# EAGLE design Power_Amp (EAGLE 9.6.2)
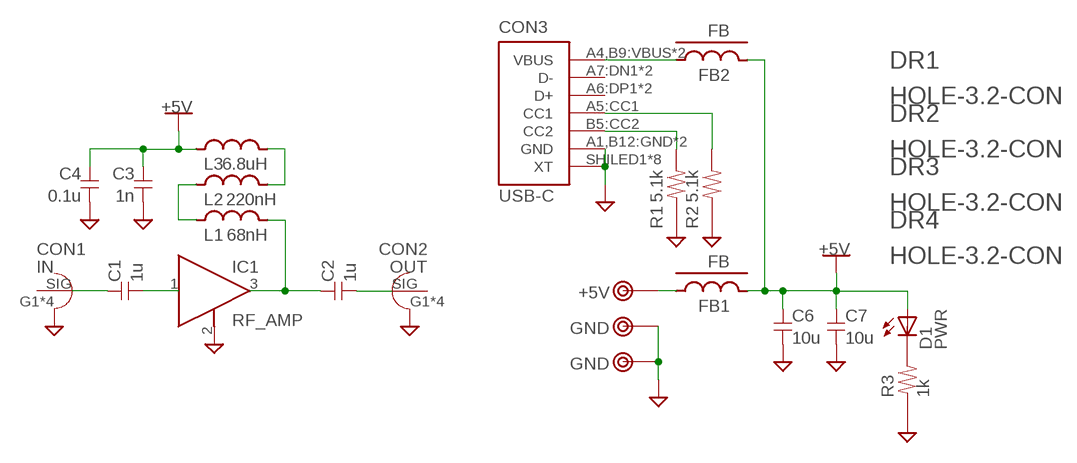
[diagram p0: schematic, sheet 1]

## Parts
C1  1u  C-1608-3  [1608-3]
C2  1u  C-1608-3  [1608-3]
C3  1n  C-1005  [1005]
C4  0.1u  C-1608  [1608C]
C6  10u  C-2012  [2012]
C7  10u  C-2012  [2012]
CON1  IN  SMA-EDGE3  [SMA-EDGE3]
CON2  OUT  SMA-EDGE3  [SMA-EDGE3]
CON3  USB-C  [5077CR-16-SMC2-BK-TR]
D1  PWR  LED-SMD1608  [D1608]
DR1  HOLE-3.2-CON  [HOLE_3.2_CON]
DR2  HOLE-3.2-CON  [HOLE_3.2_CON]
DR3  HOLE-3.2-CON  [HOLE_3.2_CON]
DR4  HOLE-3.2-CON  [HOLE_3.2_CON]
FB1  FB  FB-1608FB  [1608-FB]
FB2  FB  FB-1608FB  [1608-FB]
IC1  RF_AMP  [SOT89]
L1  68nH  L-1005  [1005]
L2  220nH  L-1608  [1608]
L3  6.8uH  L-1608  [1608]
R1  5.1k  R-1608  [1608]
R2  5.1k  R-1608  [1608]
R3  1k  R-1608  [1608]
TP1  +5V  TESTPIN  [TESTPIN]
TP2  GND  TESTPIN  [TESTPIN]
TP3  GND  TESTPIN  [TESTPIN]

## Nets
+5V: C3.1 C4.1 C6.1 C7.1 D1.A FB1.2 FB2.2 L3.1
GND: C3.2 C4.2 C6.2 C7.2 CON1.G1(GND) CON1.G2(GND) CON1.G3(GND) CON1.G4(GND) CON2.G1(GND) CON2.G2(GND) CON2.G3(GND) CON2.G4(GND) CON3.A1,B12:GND(GND) CON3.B1,A12:GND(GND) CON3.SHILED1(XT) CON3.SHILED2(XT) CON3.SHILED3(XT) CON3.SHILED4(XT) CON3.SHILED5(XT) CON3.SHILED6(XT) CON3.SHILED7(XT) CON3.SHILED8(XT) IC1.2(GND) R1.1 R2.1 R3.1 TP2.1 TP3.1
N$1: C1.2 IC1.1(IN)
N$2: C1.1 CON1.SIG
N$3: C2.1 IC1.3(OUT) L1.2
N$4: L1.1 L2.1
N$5: L2.2 L3.2
N$6: C2.2 CON2.SIG
N$7: FB1.1 TP1.1
N$8: D1.K R3.2
N$9: CON3.B5:CC2(CC2) R1.2
N$10: CON3.A5:CC1(CC1) R2.2
N$11: CON3.A4,B9:VBUS(VBUS) CON3.B4,A9:VBUS(VBUS) FB2.1
Unconnected: CON3.A6:DP1(D+) CON3.A7:DN1(D-) CON3.B6:DP2(D+) CON3.B7:DN2(D-)

## Library data of the parts
C1-C4 C6 C7 = my_rcl:C
CON1 CON2 = my_connector:SMA
CON3 = my_connector:USB-C
D1 = my_rcl:LED
DR1-DR4 = my_connector:HOLE-3.2
FB1 FB2 = my_rcl:FB
IC1 = my_ic:RF_AMP
L1-L3 = my_rcl:L
R1-R3 = my_rcl:R
TP1-TP3 = my_connector:TESTPIN

## Board
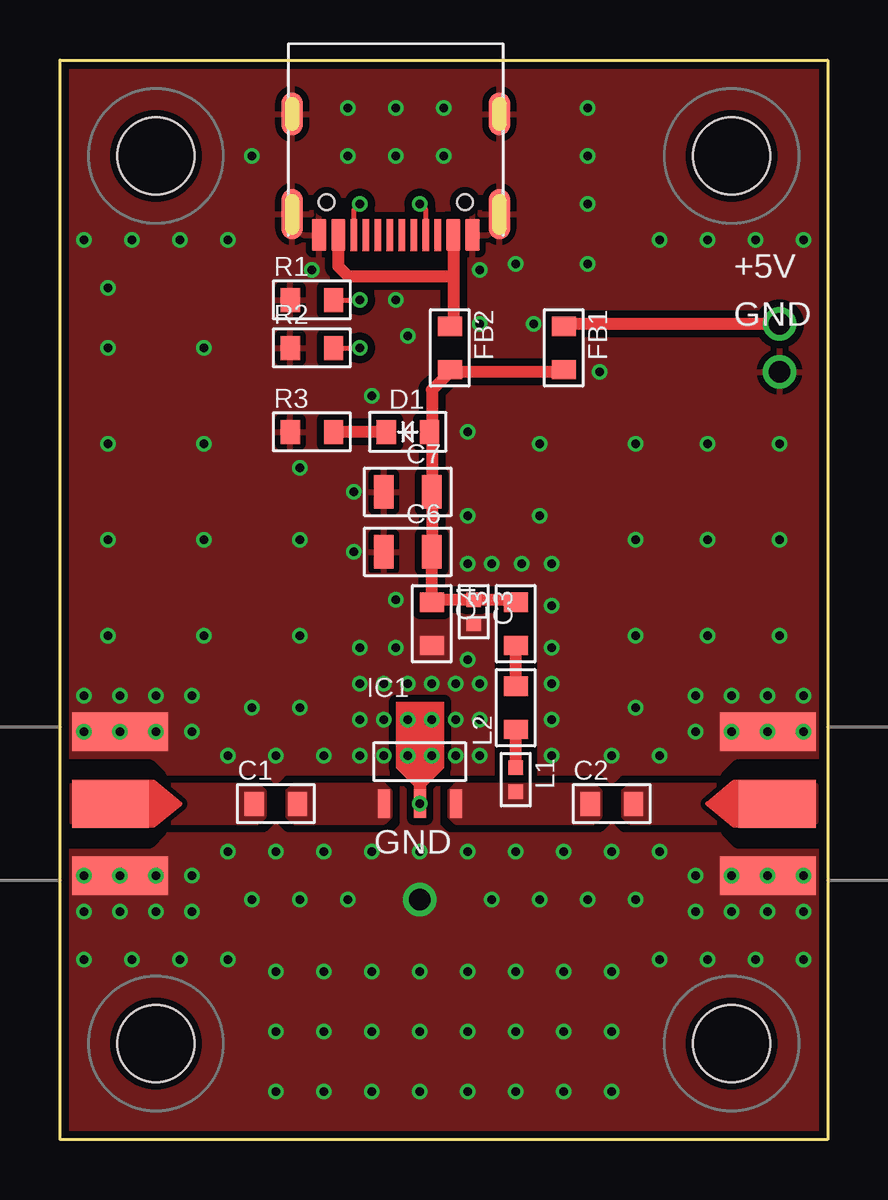
[diagram p1: board, top side]
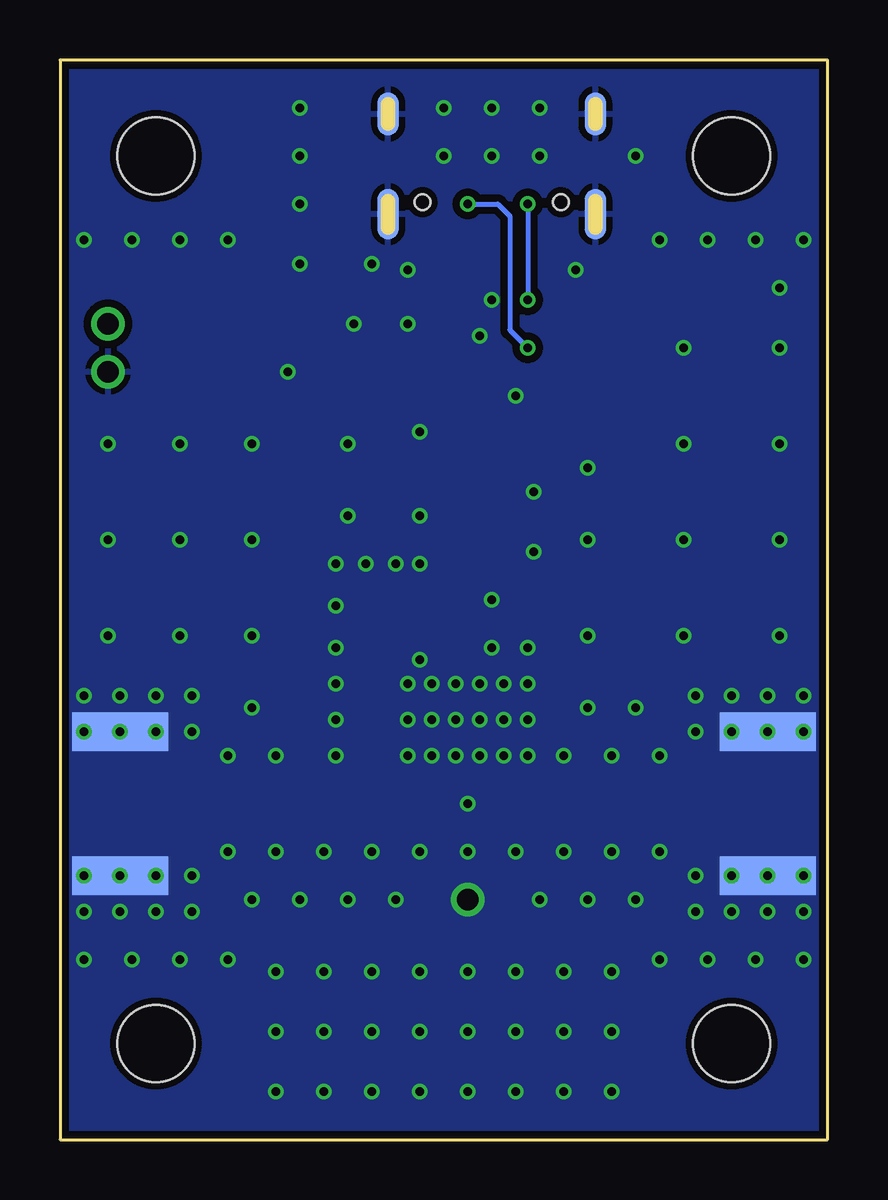
[diagram p2: board, bottom side, seen from below]

Size 32 x 45 mm. Coordinates in mm from the lower left corner, seen from the top.
Outline: 0,0 0,45 32,45 32,0 0,0
Copper layers (1*16): Top 0.035mm / dielectric 1.5mm / Bottom 0.035mm
Design rules "SeeedStudio_2layer_DRU_20140221 *": minimum track width 6mil, minimum drill 0.3mm, track to track 8mil, track to pad 8mil, pad to pad 7mil, via to via 12mil, smd to smd 0mil, copper to edge 0.3mm, drill to drill 10mil, minimum pad ring 0.15mm, minimum via ring 6mil, stop-mask expansion 2mil, vias tented up to drill 1mm, thermal gap 10mil

### Footprints (pad centres in the part's own frame; a part is rotated, then mirrored left to right if it is on the bottom)
1608-3 = smd 0.8 x 1: 1 -0.9,0; 2 0.9,0
1005 = smd 0.6 x 0.6: 1 -0.5,0; 2 0.5,0
1608C = smd 0.8 x 1: 1 -0.9,0; 2 0.9,0
2012 = smd 0.8 x 1.4: 1 -1,0; 2 1,0
SMA-EDGE3 = smd 1.6 x 4: G1 -3,0; G2 3,0 | smd 1.6 x 4 bottom: G3 -3,0; G4 3,0 | smd 2 x 3.2: SIG 0,0.4
5077CR-16-SMC2-BK-TR = smd 0.6 x 1.34: A1,B12:GND -3.2,0.3; A4,B9:VBUS -2.4,0.3; B1,A12:GND 3.2,0.3; B4,A9:VBUS 2.4,0.3 | smd 0.3 x 1.34: A5:CC1 -1.25,0.3; A6:DP1 -0.25,0.3; A7:DN1 0.25,0.3; A8:SBU1 1.25,0.3; B5:CC2 1.75,0.3; B6:DP2 0.75,0.3; B7:DN2 -0.75,0.3; B8:SBU2 -1.75,0.3 | smd 0.9 x 2.1: SHILED1 -4.32,-0.57; SHILED2 4.32,-0.57 | smd 0.9 x 1.8: SHILED3 -4.32,-4.75; SHILED4 4.32,-4.75 | smd 0.9 x 2.1 bottom: SHILED5 -4.32,-0.57; SHILED7 4.32,-0.57 | smd 0.9 x 1.8 bottom: SHILED6 -4.32,-4.75; SHILED8 4.32,-4.75 | hole 0.65: -2.89,-1.07; 2.89,-1.07
D1608 = smd 0.8 x 1: A 0.9,0; K -0.9,0
HOLE_3.2_CON = hole 3.2: 0,0
1608-FB = smd 0.8 x 1: 1 -0.9,0; 2 0.9,0
SOT89 = smd 0.5 x 1.2: 1 -1.5,-1.75; 2 0,-1.75; 3 1.5,-1.75
1608 = smd 0.8 x 1: 1 -0.9,0; 2 0.9,0
TESTPIN = drill 0.9 pad 1.4: 1 0,0

### Placement (x,y rotation side)
C1  9,14 0 top
C2  23,14 0 top
C3  17.25,22 270 top
C4  15.5,21.5 270 top
C6  14.5,24.5 180 top
C7  14.5,27 180 top
CON1  2.5,14 90 top
CON2  29.5,14 270 top
CON3  14,38 180 top
D1  14.5,29.5 0 top
DR1  4,4 0 top
DR2  28,4 0 top
DR3  28,41 0 top
DR4  4,41 0 top
FB1  21,33 270 top
FB2  16.25,33 270 top
IC1  15,15.75 0 top
L1  19,15 270 top
L2  19,18 90 top
L3  19,21.5 270 top
R1  10.5,35 0 top
R2  10.5,33 0 top
R3  10.5,29.5 0 top
TP1  30,34 0 top
TP2  30,32 0 top
TP3  15,10 0 top

### Tracks (layer width: path | path; a pad name or v marks a point on that pad's centre or on a via)
+5V
  Top 0.508: L3.1 18.9,22.5 C3.1 15.6,22.5 C4.1 C6.1 C7.1 15.5,29.5 | 15.5,29.5 15.5,31.25 16.25,32 FB2.2 16.35,32 20.9,32 FB1.2 | D1.A 15.5,29.5
GND  (via drill 0.35)
  other vias: 1,17 2.5,17 4,17 4,18.5 2.5,18.5 1,18.5 5.5,18.5 5.5,17 1,11 2.5,11 4,11 5.5,11 5.5,9.5 4,9.5 2.5,9.5 1,9.5 31,17 29.5,17 28,17 26.5,17 26.5,18.5 28,18.5 29.5,18.5 31,18.5 31,11 29.5,11 28,11 26.5,11 26.5,9.5 28,9.5 29.5,9.5 31,9.5 14.5,17.5 15.5,17.5 15.5,16 14.5,16 16.5,17.5 16.5,16 17.5,16 17.5,17.5 17.5,19 16.5,19 15.5,19 14.5,19 13.5,19 13.5,17.5 13.5,16 12.5,16 12.5,17.5 12.5,19 7,16 7,12 9,12 9,16 11,16 11,12 13,12 15,12 17,12 19,12 23,16 23,12 25,12 25,16 21,12 20.5,16 12,10 10,10 18,10 20,10 22,10 12.25,27 12.25,24.5 17,20 14,20.5 12.5,20.5 20.5,17.5 20.5,19 20.5,20.5 20.5,22.25 20.5,24 19.25,24 18,24 17,24 14,22.5 8,18 10,18 24,18 17,26 17,29.5 22,36.5 19,36.5 19.75,34 22.5,32 14,35 14.5,33.5 12,43 14,43 16,43 16,41 14,41 12,41 2,33 17.5,34 2,35.5 2,21 2,25 2,29 30,21 30,25 30,29 27,29 22,39 15,14 8,10 24,10 15,2 13,2 11,2 9,2 17,2 19,2 21,2 23,2 15,7 13,7 11,7 9,7 17,7 19,7 21,7 23,7 15,4.5 13,4.5 11,4.5 9,4.5 17,4.5 19,4.5 21,4.5 23,4.5 1,7.5 3,7.5 5,7.5 7,7.5 31,7.5 29,7.5 27,7.5 25,7.5 31,37.5 29,37.5 27,37.5 25,37.5 1,37.5 3,37.5 5,37.5 7,37.5 22,41 22,43 8,41 6,29 10,28 10,25 6,25 6,21 10,21 24,29 24,25 27,25 27,21 24,21 20,29 20,26 10.5,36.25 17.5,36.25 6,33 13,31
  pour Top (isolate 0.305, rank 4): 0,45 0,0 32,0 32,45
  pour Bottom (isolate 0.305, rank 4): 0,45 0,0 32,0 32,45
  cutout Top (no thermals): 18.25,23 19.75,23 19.75,15.25 18.25,15.25
  pour Bottom (isolate 0.305, rank 4, no thermals): 0,23.5 0,8 32,8 32,23.5
  pour Top (isolate 0.305, rank 4, no thermals): 0,23.5 0,8 32,8 32,23.5
N$1
  pour Top (no thermals): 9.5,14.5 9.5,13.5 9.75,13.25 13.5,13.25 13.75,13.5 13.75,14.5 13.5,14.75 9.75,14.75
N$2
  pour Top (no thermals): 0.5,14.75 0.5,13.25 8.25,13.25 8.5,13.5 8.5,14.5 8.25,14.75
N$3
  pour Top (no thermals): 16.5,14.75 16.25,14.5 16.25,13.5 16.5,13.25 22.25,13.25 22.5,13.5 22.5,14.5 22.25,14.75
N$4
  Top 0.508: L1.1 L2.1
N$5
  Top 0.508: L2.2 L3.2
N$6
  pour Top (no thermals): 23.75,14.75 23.5,14.5 23.5,13.5 23.75,13.25 31.5,13.25 31.5,14.75
N$7
  Top 0.508: FB1.1 21.1,34 TP1.1
N$8
  Top 0.508: D1.K R3.2
N$9  (via drill 0.35)
  Top 0.203: CON3.B5:CC2 12.25,38.75 v12.5,39 | R1.2 v12.5,35
  Bottom 0.203: v12.5,39 v12.5,35
N$10  (via drill 0.35)
  Top 0.203: CON3.A5:CC1 15.25,38.75 v15,39 | R2.2 v12.5,33
  Bottom 0.203: v15,39 13.75,39 13.25,38.5 13.25,33.75 v12.5,33
N$11
  Top 0.508: CON3.B4,A9:VBUS 11.6,36.4 12,36 16.4,36 | CON3.A4,B9:VBUS 16.4,36 | 16.4,36 16.4,34.05 FB2.1

### Text on the board
tStop: RF Amp Test Board